# Altium schematic sheet 4_Digitrol.SchDoc
size A3; DocumentNumber: 5; SheetNumber: 5; SheetTotal: 6
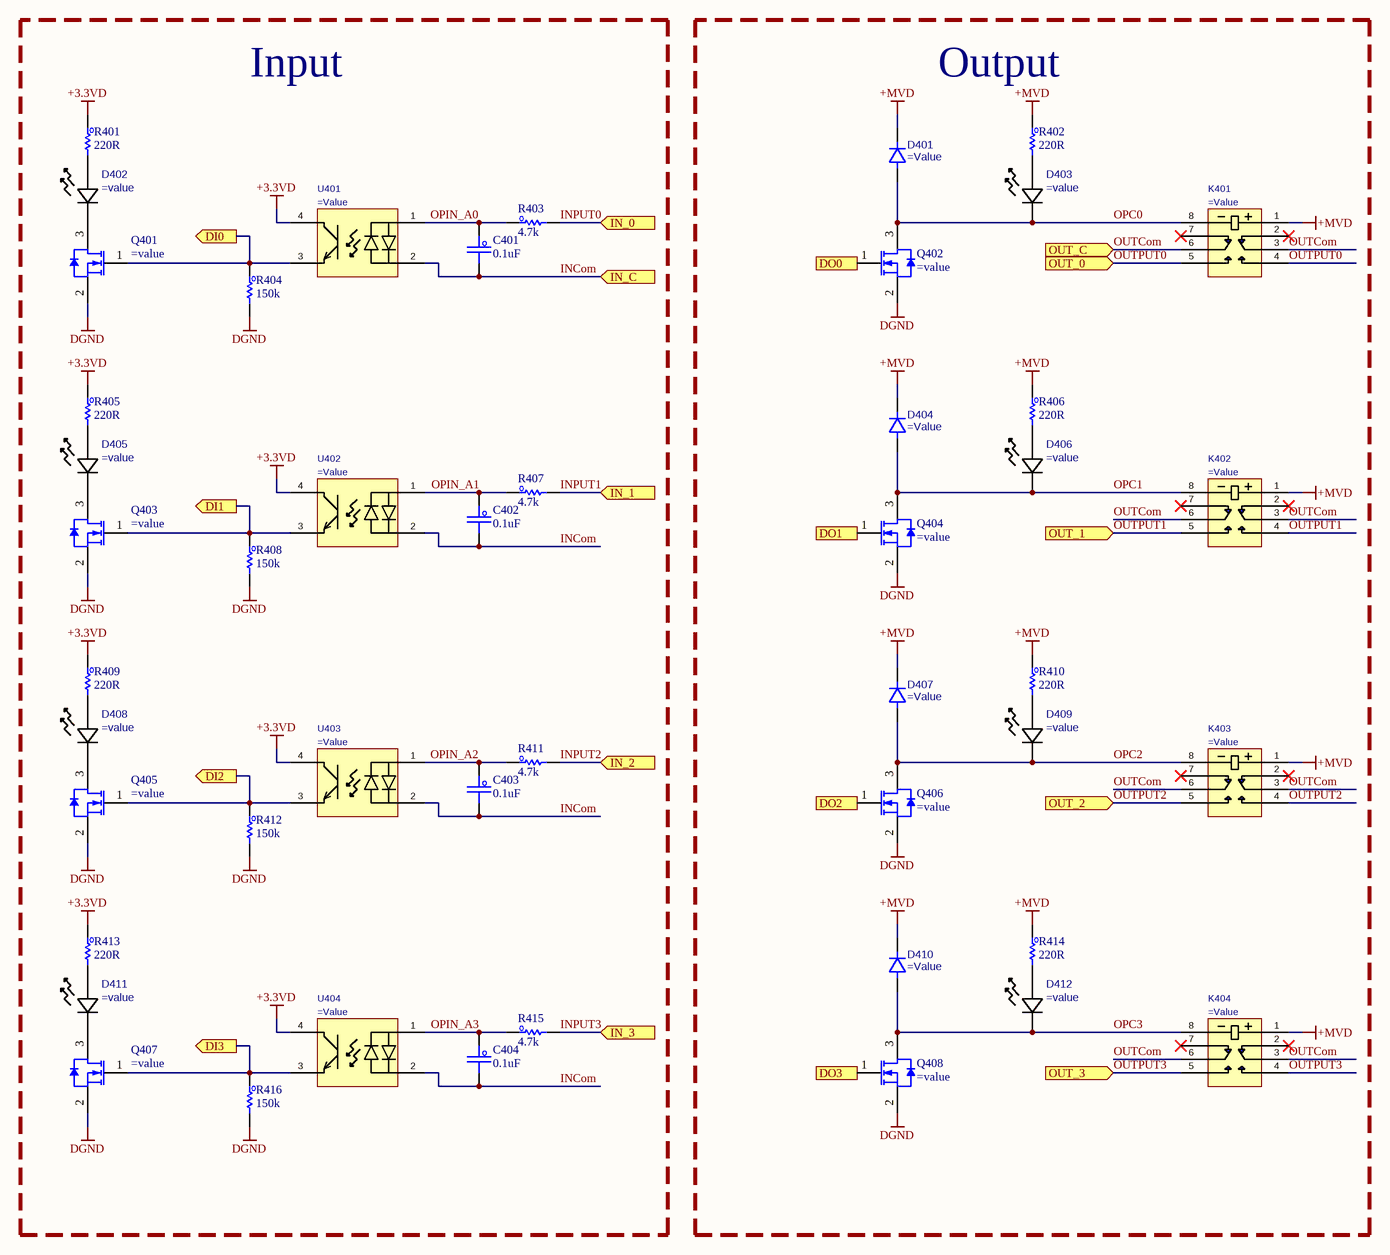
[diagram p0: 4_Digitrol.SchDoc]

## Parts
C401  0.1uF  [C_0603]
C402  0.1uF  [C_0603]
C403  0.1uF  [C_0603]
C404  0.1uF  [C_0603]
D401  (no value)  [SOD323]
D402  (no value)  [LED_0VS75000_WRE]
D403  (no value)  [LED_0VS75000_WRE]
D404  (no value)  [SOD323]
D405  (no value)  [LED_0VS75000_WRE]
D406  (no value)  [LED_0VS75000_WRE]
D407  (no value)  [SOD323]
D408  (no value)  [LED_0VS75000_WRE]
D409  (no value)  [LED_0VS75000_WRE]
D410  (no value)  [SOD323]
D411  (no value)  [LED_0VS75000_WRE]
D412  (no value)  [LED_0VS75000_WRE]
K401  (no value)  [RELAY_HFD4/12-SR]
K402  (no value)  [RELAY_HFD4/12-SR]
K403  (no value)  [RELAY_HFD4/12-SR]
K404  (no value)  [RELAY_HFD4/12-SR]
Q401  (no value)  [TRANS_CSD25481F4]
Q402  (no value)  [TRANS_CSD25481F4]
Q403  (no value)  [TRANS_CSD25481F4]
Q404  (no value)  [TRANS_CSD25481F4]
Q405  (no value)  [TRANS_CSD25481F4]
Q406  (no value)  [TRANS_CSD25481F4]
Q407  (no value)  [TRANS_CSD25481F4]
Q408  (no value)  [TRANS_CSD25481F4]
R401  220R  [R_0603]
R402  220R  [R_0603]
R403  4.7k  [R_0603]
R404  150k  [R_0603]
R405  220R  [R_0603]
R406  220R  [R_0603]
R407  4.7k  [R_0603]
R408  150k  [R_0603]
R409  220R  [R_0603]
R410  220R  [R_0603]
R411  4.7k  [R_0603]
R412  150k  [R_0603]
R413  220R  [R_0603]
R414  220R  [R_0603]
R415  4.7k  [R_0603]
R416  150k  [R_0603]
U401  (no value)  [SOIC_M618A-3T_VI]
U402  (no value)  [SOIC_M618A-3T_VI]
U403  (no value)  [SOIC_M618A-3T_VI]
U404  (no value)  [SOIC_M618A-3T_VI]

## Blocks framed on the sheet
Input: C401-C404 D402 D405 D408 D411 Q401 Q403 Q405 Q407 R401 R403-R405 R407-R409 R411-R413 R415 R416 U401-U404
Output: D401 D403 D404 D406 D407 D409 D410 D412 K401-K404 Q402 Q404 Q406 Q408 R402 R406 R410 R414

## Ports
DI0 (out), DI1 (out), DI2 (out), DI3 (out), DO0 (in), DO1 (in), DO2 (in), DO3 (in), IN_0 (in), IN_1 (in), IN_2 (in), IN_3 (in), IN_C (in), OUT_0 (in), OUT_1 (in), OUT_2 (in), OUT_3 (in), OUT_C (in)

## Nets
+3.3VD: R401.1 R405.1 R409.1 R413.1 U401.4(C) U402.4(C) U403.4(C) U404.4(C)
+MVD: D401.1 D404.1 D407.1 D410.1 K401.1 K402.1 K403.1 K404.1 R402.1 R406.1 R410.1 R414.1
DGND: Q401.2(S) Q402.2(S) Q403.2(S) Q404.2(S) Q405.2(S) Q406.2(S) Q407.2(S) Q408.2(S) R404.2 R408.2 R412.2 R416.2
DI0: Q401.1(G) R404.1 U401.3(E) ; port DI0
DI1: Q403.1(G) R408.1 U402.3(E) ; port DI1
DI2: Q405.1(G) R412.1 U403.3(E) ; port DI2
DI3: Q407.1(G) R416.1 U404.3(E) ; port DI3
DO0: Q402.1(G) ; port DO0
DO1: Q404.1(G) ; port DO1
DO2: Q406.1(G) ; port DO2
DO3: Q408.1(G) ; port DO3
INCom: C401.2 C402.2 C403.2 C404.2 U401.2(C_2) U402.2(C_2) U403.2(C_2) U404.2(C_2) ; port IN_C
INPUT0: R403.2 ; port IN_0
INPUT1: R407.2 ; port IN_1
INPUT2: R411.2 ; port IN_2
INPUT3: R415.2 ; port IN_3
OPC0: D401.2 D403.1 K401.8 Q402.3(D)
OPC1: D404.2 D406.1 K402.8 Q404.3(D)
OPC2: D407.2 D409.1 K403.8 Q406.3(D)
OPC3: D410.2 D412.1 K404.8 Q408.3(D)
OPIN_A0: C401.1 R403.1 U401.1(A)
OPIN_A1: C402.1 R407.1 U402.1(A)
OPIN_A2: C403.1 R411.1 U403.1(A)
OPIN_A3: C404.1 R415.1 U404.1(A)
OUTCom: K401.3 K401.6 K402.3 K402.6 K403.3 K403.6 K404.3 K404.6 ; port OUT_C
OUTPUT0: K401.4 K401.5 ; port OUT_0
OUTPUT1: K402.4 K402.5 ; port OUT_1
OUTPUT2: K403.4 K403.5 ; port OUT_2
OUTPUT3: K404.4 K404.5 ; port OUT_3
NetD402_1: D402.1 Q401.3(D)
NetD402_2: D402.2 R401.2
NetD403_2: D403.2 R402.2
NetD405_1: D405.1 Q403.3(D)
NetD405_2: D405.2 R405.2
NetD406_2: D406.2 R406.2
NetD408_1: D408.1 Q405.3(D)
NetD408_2: D408.2 R409.2
NetD409_2: D409.2 R410.2
NetD411_1: D411.1 Q407.3(D)
NetD411_2: D411.2 R413.2
NetD412_2: D412.2 R414.2

Not connected (* = marked no-connect by the designer): K401 2* 7*; K402 2* 7*; K403 2* 7*; K404 2* 7*

## Notes on the sheet
- Title :
- Revision :
- ผู้จัดทำ:
- Size:
- A3
- Time:
- ผู้เขียน:
- บริษัท ยูนิเวอร์แซล ยูทีลิตี้ส์ จำกัด (มหาชน) เลขที่ 1 อาคาร อีสท์วอเตอร์ ชั้น 18 ซอยวิภาวดีรังสิต 5 แขวงจอมพล เขตจตุจักร กรุงเทพฯ 10900
  Tel : +662-272-1688
  Fax :+662-2721690-1
- -
- Sheet:
- of
- ผู้อำนวยการ
- ผู้ตรวจสอบ:
- Number:
- กรรมการผู้จัดการ:
- File:

## Library data of the parts
C401-C404 = C_Capacitor: CAP CER 0.1UF 50V X7R 0603; Manufacturer: KEMET; PartNumber: C0603C104K5RACTU; PackageReference: 0603; PartID: 399-5089-1-ND; Value2: 50V; Value: 0.1uF; Value3: *
D401 D404 D407 D410 = D_PW_SD103AWS: DIODE SCHOTTKY 40V 2A 0603; Manufacturer: Slkor(SLKORMICRO Elec.); Value: SD103AWS; PackageReference: SOD-323; PartID: C513472; PartNumber: SD103AWS
D402 D403 D405 D406 D408 D409 D411 D412 = D_LED_150060BS75000: LED BLUE CLEAR 0603 SMD; Manufacturer: Wurth Electronics; Value: 150060VS75000; PackageReference: 0603; PartID: 732-4980-1-ND; PartNumber: 150060VS75000
K401-K404 = SW_RELAY_HFD4/12-SR: Telecom Non Latching 12VDC DPDT SMD Relays RoHS; Manufacturer: Xiamen Hongfa Electroacoustic; Value: HFD4/5-SR; PackageReference: *; PartID: C64399; PartNumber: HFD4/5-SR
Q401-Q408 = Q_NMOS_CSD17382F4: MOSFET N-CH 30V 2.3A 3PICOSTAR; Manufacturer: Texas Instruments; Value: CSD17382F4; PackageReference: XFDFN-3; PartID: 296-49600-1-ND; PartNumber: CSD17382F4; Value3: *
R401 R402 R405 R406 R409 R410 R413 R414 = R_Resister: RES SMD 220 OHM 1% 1/10W 0603; Manufacturer: Vishay Dale; PartNumber: CRCW0603220RFKEAC; Value2: 0.1W; Value: 220R; PackageReference: 0603; PartID: 541-4047-1-ND; Value3: *
R403 R407 R411 R415 = R_Resister: RES 4.7K OHM 5% 1/10W 0603; Manufacturer: Vishay Dale; PartNumber: CRCW06034K70JNEBC; Value2: 0.1W; Value: 4.7k; PackageReference: 0603; PartID: 541-CRCW06034K70JNEBCCT-ND; Value3: *
R404 R408 R412 R416 = R_Resister: RES SMD 150K OHM 1% 1/10W 0603; Manufacturer: Vishay Dale; PartNumber: CRCW0603150KFKEAC; Value2: 0.1W; Value: 150k; PackageReference: 0603; PartID: 541-4034-1-ND; Value3: *
U401-U404 = IC_OPTO_LTV-814S-TA1: OPTOISOLATR 5KV TRANSISTOR 4-SMD; Manufacturer: Lite-On Inc.; Value: LTV-814S-TA1; PackageReference: 4-SOP; PartID: 160-1891-1-ND; PartNumber: LTV-814S-TA1